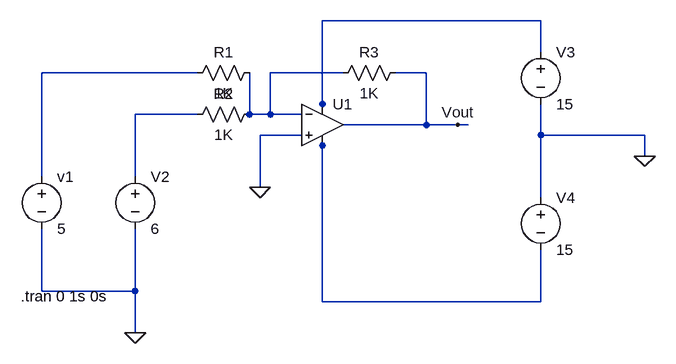
[diagram p0: schematic Adder_LTSpice.asc]
Adder_LTSpice.asc, the LTspice schematic file:
Version 4
SHEET 1 880 680
WIRE 640 -64 304 -64
WIRE 640 -16 640 -64
WIRE 112 16 -128 16
WIRE 336 16 224 16
WIRE 464 16 416 16
WIRE 304 64 304 -64
WIRE 112 80 16 80
WIRE 192 80 192 16
WIRE 224 80 224 16
WIRE 224 80 192 80
WIRE 272 80 224 80
WIRE 304 80 304 64
WIRE 464 96 464 16
WIRE 464 96 336 96
WIRE 512 96 464 96
WIRE 528 96 512 96
WIRE 272 112 208 112
WIRE 640 112 640 64
WIRE 800 112 640 112
WIRE 304 128 304 112
WIRE 800 144 800 112
WIRE -128 176 -128 16
WIRE 16 176 16 80
WIRE 208 192 208 112
WIRE 640 208 640 112
WIRE -128 352 -128 256
WIRE 16 352 16 256
WIRE 16 352 -128 352
WIRE 304 368 304 128
WIRE 640 368 640 288
WIRE 640 368 304 368
WIRE 16 416 16 352
FLAG 208 192 0
FLAG 800 144 0
FLAG 16 416 0
FLAG 512 96 Vout
SYMBOL voltage -128 160 R0
WINDOW 123 0 0 Left 2
WINDOW 39 0 0 Left 2
SYMATTR InstName v1
SYMATTR Value 5
SYMBOL voltage 16 160 R0
WINDOW 123 0 0 Left 2
WINDOW 39 0 0 Left 2
SYMATTR InstName V2
SYMATTR Value 6
SYMBOL res 208 64 R90
WINDOW 0 0 56 VBottom 2
WINDOW 3 32 56 VTop 2
SYMATTR InstName R2
SYMATTR Value 1K
SYMBOL res 432 0 R90
WINDOW 0 0 56 VBottom 2
WINDOW 3 32 56 VTop 2
SYMATTR InstName R3
SYMATTR Value 1K
SYMBOL res 208 0 R90
WINDOW 0 0 56 VBottom 2
WINDOW 3 32 56 VTop 2
SYMATTR InstName R1
SYMATTR Value 1K
SYMBOL voltage 640 -32 R0
WINDOW 123 0 0 Left 2
WINDOW 39 0 0 Left 2
SYMATTR InstName V3
SYMATTR Value 15
SYMBOL voltage 640 192 R0
WINDOW 123 0 0 Left 2
WINDOW 39 0 0 Left 2
SYMATTR InstName V4
SYMATTR Value 15
SYMBOL Opamps\\UniversalOpamp2 304 96 R0
SYMATTR InstName U1
TEXT -160 360 Left 2 !.tran 0 1s 0s

The netlist it stands for:
* Adder_LTSpice.asc
v1 N002 0 5
V2 N004 0 6
R2 N003 N004 1K
R3 Vout N003 1K
R1 N003 N002 1K
V3 N001 0 15
V4 0 N005 15
XU1 0 N003 N001 N005 Vout level.2 Avol=1Meg GBW=10Meg Slew=10Meg ilimit=25m rail=0 Vos=0 phimargin=45 en=0 enk=0 in=0 ink=0 Rin=500Meg  ; pins IN+ IN- V+ V- OUT
.tran 0 1s 0s
.lib UniversalOpamps2.sub
.backanno
.end